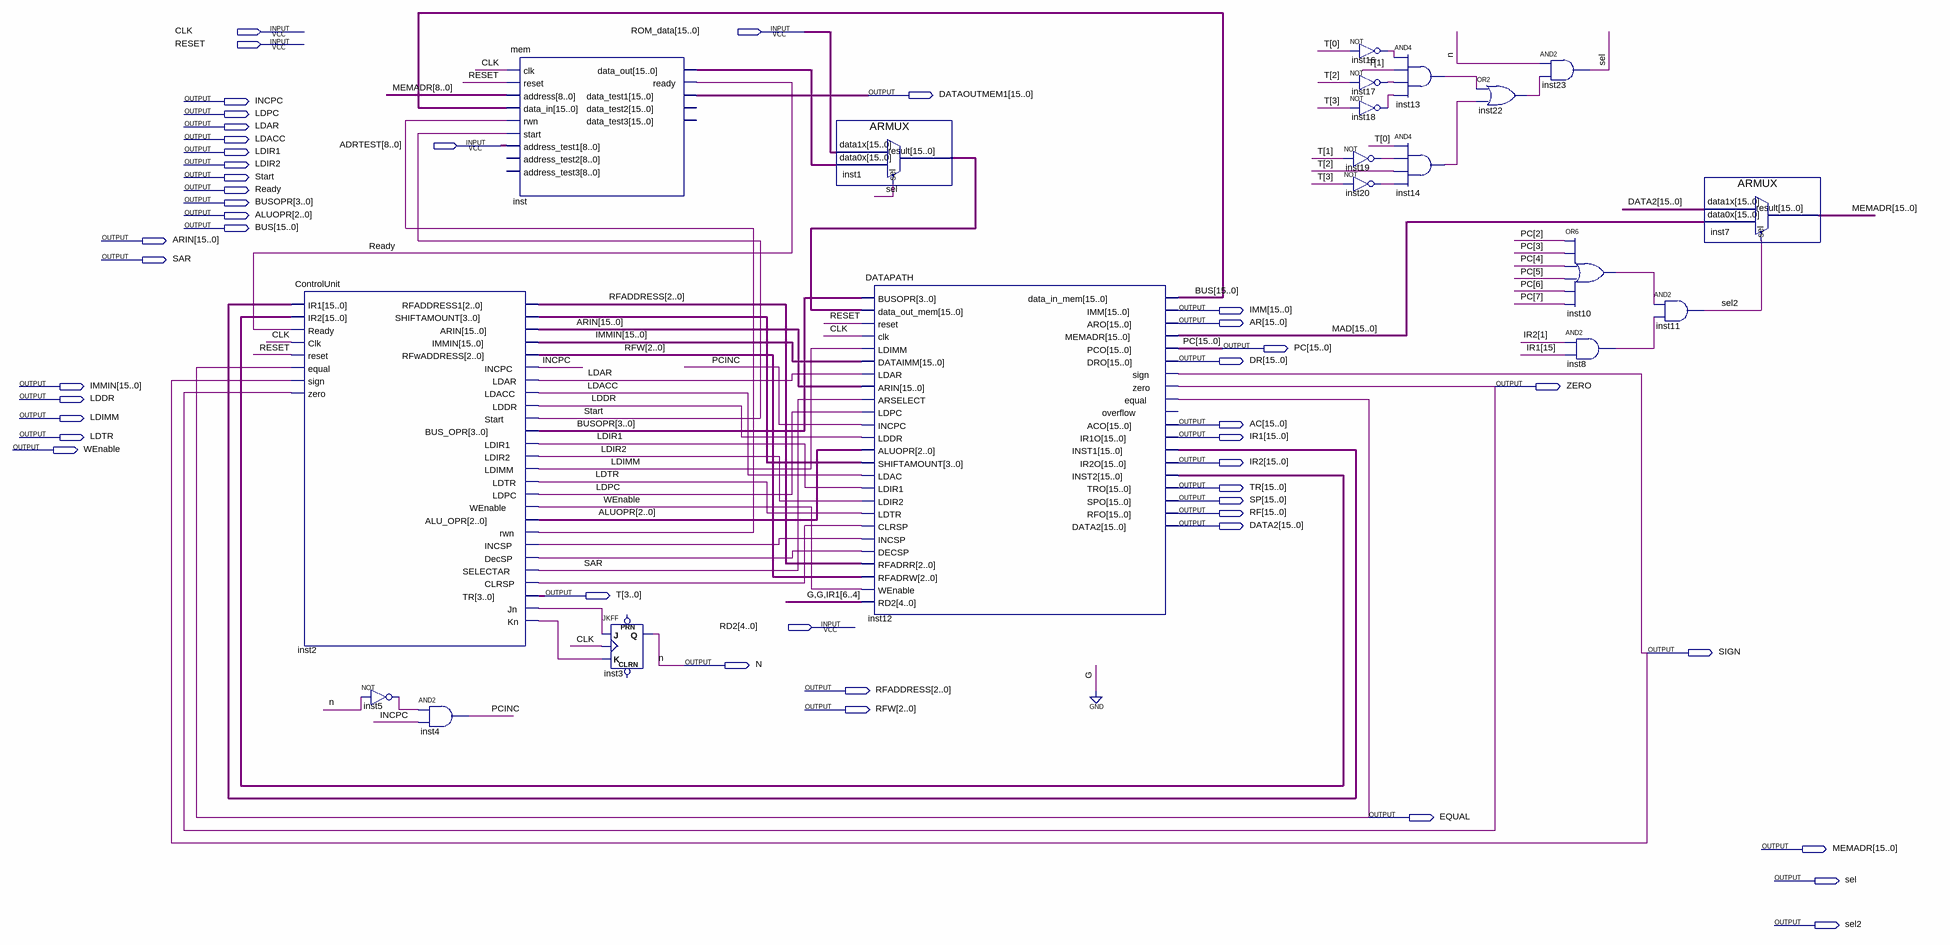
[diagram p0: schematic sheet]
// Quartus schematic CPU.bdf as structural Verilog: 20 symbols, 45 pins
module CPU (
  input  CLK,
  input  [15:0] ROM_data,
  input  RESET,
  input  [8:0] ADRTEST,
  input  [4:0] RD2,
  output [15:0] DATAOUTMEM1,
  output INCPC,
  output LDPC,
  output LDAR,
  output LDACC,
  output LDIR1,
  output LDIR2,
  output Start,
  output Ready,
  output [3:0] BUSOPR,
  output [2:0] ALUOPR,
  output [15:0] BUS,
  output [15:0] ARIN,
  output SAR,
  output [15:0] IMM,
  output [15:0] AR,
  output [15:0] PC,
  output [15:0] DR,
  output [15:0] IMMIN,
  output ZERO,
  output LDDR,
  output LDIMM,
  output [15:0] AC,
  output LDTR,
  output [15:0] IR1,
  output WEnable,
  output [15:0] IR2,
  output [15:0] TR,
  output [15:0] SP,
  output [15:0] RF,
  output [15:0] DATA2,
  output [3:0] T,
  output SIGN,
  output N,
  output [2:0] RFADDRESS,
  output [2:0] RFW,
  output EQUAL,
  output [15:0] MEMADR,
  output sel,
  output sel2
);

  wire inst2_clrsp, inst2_decsp, inst2_incsp, inst2_jn, inst2_kn, inst2_rwn, inst5_out, inst8_out,
       inst10_out, inst13_out, inst14_out, inst16_out, inst17_out, inst18_out, inst19_out, inst20_out,
       inst22_out, PCINC;
  wire [3:0] inst2_shiftamount;
  wire [15:0] inst1_result, inst12_inst1, inst12_inst2, inst_data_out, MAD;

  ControlUnit inst2 (
    .IR1(inst12_inst1), .IR2(inst12_inst2), .Ready(Ready), .Clk(CLK), .reset(RESET), .equal(EQUAL),
    .sign(SIGN), .zero(ZERO), .RFADDRESS1(RFADDRESS), .SHIFTAMOUNT(inst2_shiftamount), .ARIN(ARIN),
    .IMMIN(IMMIN), .RFwADDRESS(RFW), .INCPC(INCPC), .LDAR(LDAR), .LDACC(LDACC), .LDDR(LDDR), .Start(Start),
    .BUS_OPR(BUSOPR), .LDIR1(LDIR1), .LDIR2(LDIR2), .LDIMM(LDIMM), .LDTR(LDTR), .LDPC(LDPC),
    .WEnable(WEnable), .ALU_OPR(ALUOPR), .rwn(inst2_rwn), .INCSP(inst2_incsp), .DecSP(inst2_decsp),
    .SELECTAR(SAR), .CLRSP(inst2_clrsp), .TR(T), .Jn(inst2_jn), .Kn(inst2_kn));
  not inst5 (inst5_out, N);
  and inst4 (PCINC, inst5_out, INCPC);
  mem inst (
    .clk(CLK), .reset(RESET), .address(MEMADR[8:0]), .data_in(BUS), .rwn(inst2_rwn), .start(Start),
    .address_test1(ADRTEST), .data_out(inst_data_out), .ready(Ready), .data_test1(DATAOUTMEM1));  // open: address_test2, address_test3, data_test2, data_test3
  JKFF inst3 (.K(inst2_kn), .J(inst2_jn), .CLK(CLK), .Q(N));  // open: PRN, CLRN
  ARMUX inst1 (.data1x(ROM_data), .data0x(inst_data_out), .sel(sel), .result(inst1_result));
  DATAPATH inst12 (
    .BUSOPR(BUSOPR), .data_out_mem(inst1_result), .reset(RESET), .clk(CLK), .LDIMM(LDIMM), .DATAIMM(IMMIN),
    .LDAR(LDAR), .ARIN(ARIN), .ARSELECT(SAR), .LDPC(LDPC), .INCPC(PCINC), .LDDR(LDDR), .ALUOPR(ALUOPR),
    .SHIFTAMOUNT(inst2_shiftamount), .LDAC(LDACC), .LDIR1(LDIR1), .LDIR2(LDIR2), .LDTR(LDTR),
    .CLRSP(inst2_clrsp), .INCSP(inst2_incsp), .DECSP(inst2_decsp), .RFADRR(RFADDRESS), .RFADRW(RFW),
    .WEnable(WEnable), .RD2({2'b00, IR1[6:4]}), .data_in_mem(BUS), .IMM(IMM), .ARO(AR), .MEMADR(MAD),
    .PCO(PC), .DRO(DR), .sign(SIGN), .zero(ZERO), .equal(EQUAL), .ACO(AC), .IR1O(IR1), .INST1(inst12_inst1),
    .IR2O(IR2), .INST2(inst12_inst2), .TRO(TR), .SPO(SP), .RFO(RF), .DATA2(DATA2));  // open: overflow
  not inst16 (inst16_out, T[0]);
  not inst17 (inst17_out, T[2]);
  not inst18 (inst18_out, T[3]);
  not inst19 (inst19_out, T[1]);
  not inst20 (inst20_out, T[3]);
  and inst13 (inst13_out, inst16_out, T[1], inst17_out, inst18_out);
  and inst14 (inst14_out, T[0], inst19_out, T[2], inst20_out);
  or inst22 (inst22_out, inst13_out, inst14_out);
  and inst23 (sel, N, inst22_out);
  or inst10 (inst10_out, PC[2], PC[3], PC[4], PC[5], PC[6], PC[7]);
  and inst8 (inst8_out, IR2[1], IR1[15]);
  and inst11 (sel2, inst10_out, inst8_out);
  ARMUX inst7 (.data1x(DATA2), .data0x(MAD), .sel(sel2), .result(MEMADR));
endmodule
